# Altium schematic sheet Main.SchDoc
size A3
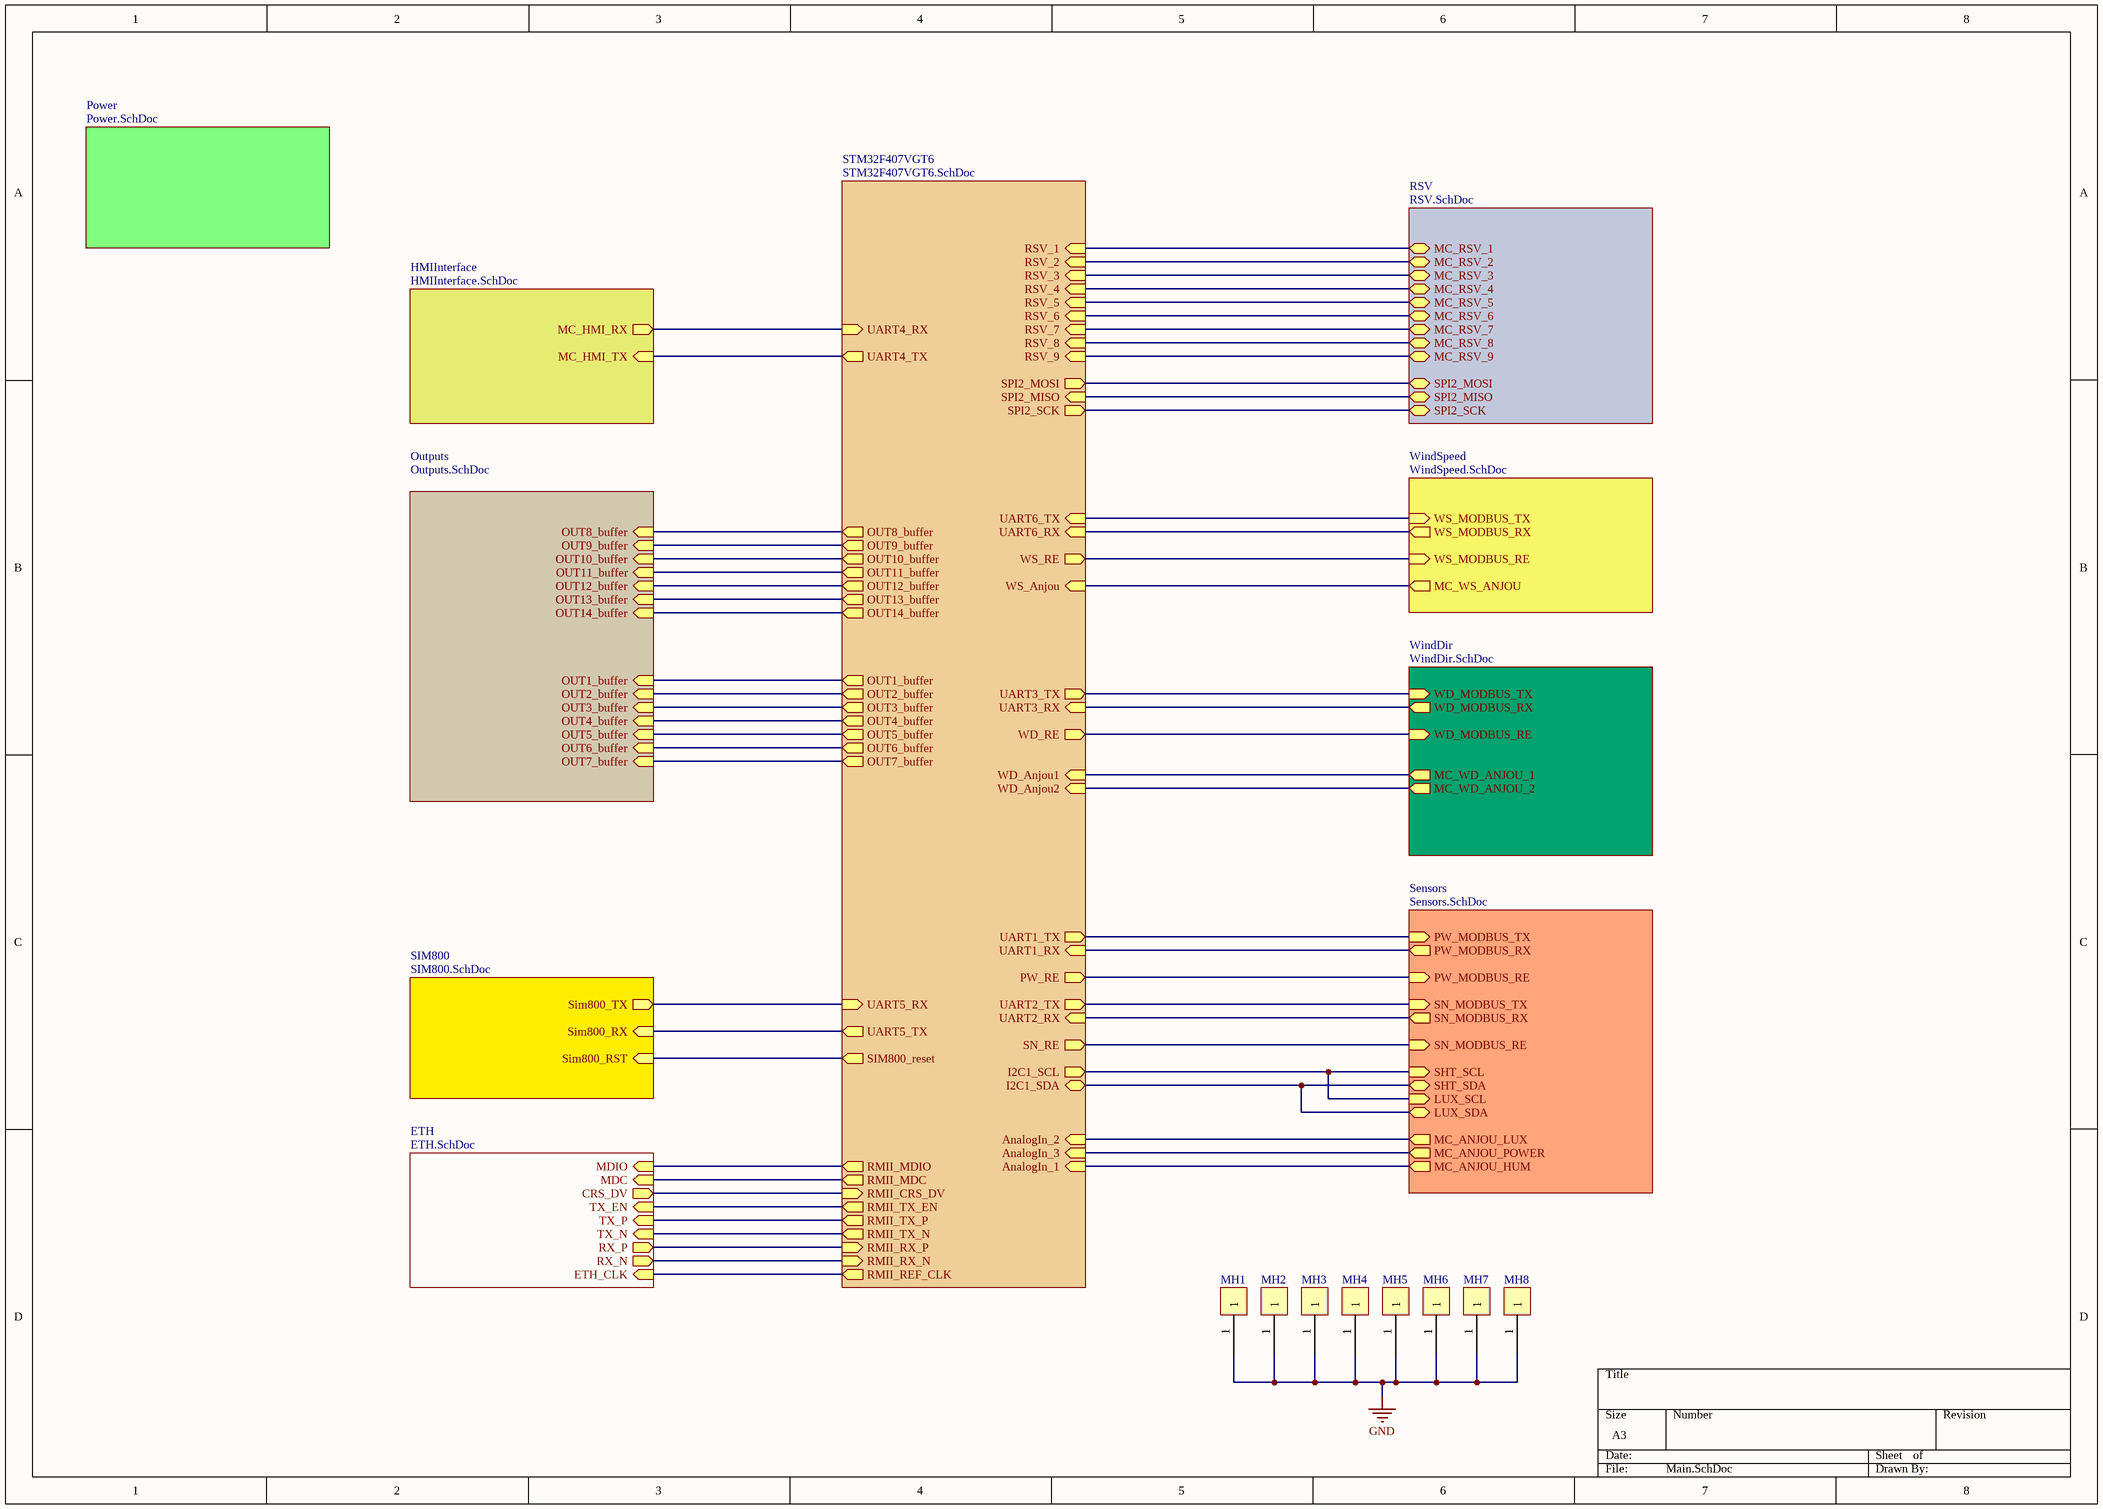
[diagram p0: Main.SchDoc]

## Parts
MH1  HOLE_3mm  [Hole_3mm]  (value not drawn)
MH2  HOLE_3mm  [Hole_3mm]  (value not drawn)
MH3  HOLE_3mm  [Hole_3mm]  (value not drawn)
MH4  HOLE_3mm  [Hole_3mm]  (value not drawn)
MH5  HOLE_3mm  [Hole_3mm]  (value not drawn)
MH6  HOLE_3mm  [Hole_3mm]  (value not drawn)
MH7  HOLE_3mm  [Hole_3mm]  (value not drawn)
MH8  HOLE_3mm  [Hole_3mm]  (value not drawn)

## Sub-sheets
ETH = ETH.SchDoc: ETH_CLK (in), TX_P (in), TX_N (in), CRS_DV (out), RX_N (out), RX_P (out), TX_EN (in), MDC (in), MDIO (in)
HMIInterface = HMIInterface.SchDoc: MC_HMI_RX (out), MC_HMI_TX (in)
Outputs = Outputs.SchDoc: OUT13_buffer (in), OUT6_buffer (in), OUT14_buffer (in), OUT8_buffer (in), OUT7_buffer (in), OUT10_buffer (in), OUT11_buffer (in), OUT4_buffer (in), OUT3_buffer (in), OUT12_buffer (in), OUT9_buffer (in), OUT5_buffer (in), OUT2_buffer (in), OUT1_buffer (in)
Power = Power.SchDoc: no entries
RSV = RSV.SchDoc: MC_RSV_9, MC_RSV_6, MC_RSV_3, MC_RSV_8, MC_RSV_5, MC_RSV_2, MC_RSV_7, MC_RSV_1, MC_RSV_4, SPI2_MOSI, SPI2_MISO, SPI2_SCK
Sensors = Sensors.SchDoc: SN_MODBUS_TX (in), SN_MODBUS_RX (out), SHT_SCL (in), SHT_SDA (bidir), SN_MODBUS_RE (in), LUX_SDA (bidir), LUX_SCL (in), PW_MODBUS_TX (in), MC_ANJOU_HUM (out), PW_MODBUS_RX (out), PW_MODBUS_RE (in), MC_ANJOU_LUX (out), MC_ANJOU_POWER (out)
SIM800 = SIM800.SchDoc: Sim800_RX (in), Sim800_TX (out), Sim800_RST (in)
STM32F407VGT6 = STM32F407VGT6.SchDoc: RMII_MDIO (out), RMII_TX_EN (out), RMII_TX_N (out), RMII_CRS_DV (in), RMII_MDC (out), RMII_RX_P (in), RMII_RX_N (in), RMII_TX_P (out), RMII_REF_CLK (out), UART6_RX (in), UART6_TX (in), UART1_TX (out), UART1_RX (in), UART3_RX (in), UART3_TX (out), UART2_TX (out), UART2_RX (in), UART5_RX (in), UART4_TX (out), UART4_RX (in), UART5_TX (out), WD_RE (out), WD_Anjou1 (in), WD_Anjou2 (in), WS_RE (out), WS_Anjou (in), SN_RE (out), OUT8_buffer (out), OUT9_buffer (out), OUT10_buffer (out), OUT11_buffer (out), OUT12_buffer (out), OUT13_buffer (out), OUT14_buffer (out), OUT5_buffer (out), OUT6_buffer (out), OUT7_buffer (out), OUT1_buffer (out), OUT2_buffer (out), OUT3_buffer (out), OUT4_buffer (out), AnalogIn_2 (in), AnalogIn_3 (in), AnalogIn_1 (in), RSV_2 (in), RSV_1 (in), RSV_3 (in), RSV_4 (in), RSV_5 (in), RSV_6 (in), RSV_7 (in), RSV_8 (in), RSV_9 (in), SIM800_reset (out), SPI2_MOSI (out), SPI2_MISO (in), SPI2_SCK (out), I2C1_SCL (out), I2C1_SDA (bidir), PW_RE (out)
WindDir = WindDir.SchDoc: MC_WD_ANJOU_2 (out), WD_MODBUS_RE (in), WD_MODBUS_RX (out), WD_MODBUS_TX (in), MC_WD_ANJOU_1 (out)
WindSpeed = WindSpeed.SchDoc: WS_MODBUS_TX (in), WS_MODBUS_RE (in), MC_WS_ANJOU (out), WS_MODBUS_RX (out)

## Nets
GND: MH1.1 MH2.1 MH3.1 MH4.1 MH5.1 MH6.1 MH7.1 MH8.1
(unnamed): sheet SIM800/Sim800_RX, sheet STM32F407VGT6/UART5_TX
(unnamed): sheet SIM800/Sim800_TX, sheet STM32F407VGT6/UART5_RX
(unnamed): sheet SIM800/Sim800_RST, sheet STM32F407VGT6/SIM800_reset
(unnamed): sheet Outputs/OUT13_buffer, sheet STM32F407VGT6/OUT13_buffer
(unnamed): sheet Outputs/OUT6_buffer, sheet STM32F407VGT6/OUT6_buffer
(unnamed): sheet Outputs/OUT14_buffer, sheet STM32F407VGT6/OUT14_buffer
(unnamed): sheet Outputs/OUT8_buffer, sheet STM32F407VGT6/OUT8_buffer
(unnamed): sheet Outputs/OUT7_buffer, sheet STM32F407VGT6/OUT7_buffer
(unnamed): sheet Outputs/OUT10_buffer, sheet STM32F407VGT6/OUT10_buffer
(unnamed): sheet Outputs/OUT11_buffer, sheet STM32F407VGT6/OUT11_buffer
(unnamed): sheet Outputs/OUT4_buffer, sheet STM32F407VGT6/OUT4_buffer
(unnamed): sheet Outputs/OUT3_buffer, sheet STM32F407VGT6/OUT3_buffer
(unnamed): sheet Outputs/OUT12_buffer, sheet STM32F407VGT6/OUT12_buffer
(unnamed): sheet Outputs/OUT9_buffer, sheet STM32F407VGT6/OUT9_buffer
(unnamed): sheet Outputs/OUT5_buffer, sheet STM32F407VGT6/OUT5_buffer
(unnamed): sheet Outputs/OUT2_buffer, sheet STM32F407VGT6/OUT2_buffer
(unnamed): sheet Outputs/OUT1_buffer, sheet STM32F407VGT6/OUT1_buffer
(unnamed): sheet HMIInterface/MC_HMI_RX, sheet STM32F407VGT6/UART4_RX
(unnamed): sheet HMIInterface/MC_HMI_TX, sheet STM32F407VGT6/UART4_TX
(unnamed): sheet ETH/ETH_CLK, sheet STM32F407VGT6/RMII_REF_CLK
(unnamed): sheet ETH/TX_P, sheet STM32F407VGT6/RMII_TX_P
(unnamed): sheet ETH/TX_N, sheet STM32F407VGT6/RMII_TX_N
(unnamed): sheet ETH/CRS_DV, sheet STM32F407VGT6/RMII_CRS_DV
(unnamed): sheet ETH/RX_N, sheet STM32F407VGT6/RMII_RX_N
(unnamed): sheet ETH/RX_P, sheet STM32F407VGT6/RMII_RX_P
(unnamed): sheet ETH/TX_EN, sheet STM32F407VGT6/RMII_TX_EN
(unnamed): sheet ETH/MDC, sheet STM32F407VGT6/RMII_MDC
(unnamed): sheet ETH/MDIO, sheet STM32F407VGT6/RMII_MDIO
(unnamed): sheet RSV/MC_RSV_9, sheet STM32F407VGT6/RSV_9
(unnamed): sheet RSV/MC_RSV_6, sheet STM32F407VGT6/RSV_6
(unnamed): sheet RSV/MC_RSV_3, sheet STM32F407VGT6/RSV_3
(unnamed): sheet RSV/MC_RSV_8, sheet STM32F407VGT6/RSV_8
(unnamed): sheet RSV/MC_RSV_5, sheet STM32F407VGT6/RSV_5
(unnamed): sheet RSV/MC_RSV_2, sheet STM32F407VGT6/RSV_2
(unnamed): sheet RSV/MC_RSV_7, sheet STM32F407VGT6/RSV_7
(unnamed): sheet RSV/MC_RSV_1, sheet STM32F407VGT6/RSV_1
(unnamed): sheet RSV/MC_RSV_4, sheet STM32F407VGT6/RSV_4
(unnamed): sheet RSV/SPI2_MOSI, sheet STM32F407VGT6/SPI2_MOSI
(unnamed): sheet RSV/SPI2_MISO, sheet STM32F407VGT6/SPI2_MISO
(unnamed): sheet RSV/SPI2_SCK, sheet STM32F407VGT6/SPI2_SCK
(unnamed): sheet WindSpeed/WS_MODBUS_TX, sheet STM32F407VGT6/UART6_TX
(unnamed): sheet WindSpeed/WS_MODBUS_RE, sheet STM32F407VGT6/WS_RE
(unnamed): sheet WindSpeed/MC_WS_ANJOU, sheet STM32F407VGT6/WS_Anjou
(unnamed): sheet WindSpeed/WS_MODBUS_RX, sheet STM32F407VGT6/UART6_RX
(unnamed): sheet WindDir/MC_WD_ANJOU_2, sheet STM32F407VGT6/WD_Anjou2
(unnamed): sheet WindDir/WD_MODBUS_RE, sheet STM32F407VGT6/WD_RE
(unnamed): sheet WindDir/WD_MODBUS_RX, sheet STM32F407VGT6/UART3_RX
(unnamed): sheet WindDir/WD_MODBUS_TX, sheet STM32F407VGT6/UART3_TX
(unnamed): sheet WindDir/MC_WD_ANJOU_1, sheet STM32F407VGT6/WD_Anjou1
(unnamed): sheet Sensors/SN_MODBUS_TX, sheet STM32F407VGT6/UART2_TX
(unnamed): sheet Sensors/SN_MODBUS_RX, sheet STM32F407VGT6/UART2_RX
(unnamed): sheet Sensors/SHT_SCL, sheet Sensors/LUX_SCL, sheet STM32F407VGT6/I2C1_SCL
(unnamed): sheet Sensors/SHT_SDA, sheet Sensors/LUX_SDA, sheet STM32F407VGT6/I2C1_SDA
(unnamed): sheet Sensors/SN_MODBUS_RE, sheet STM32F407VGT6/SN_RE
(unnamed): sheet Sensors/PW_MODBUS_TX, sheet STM32F407VGT6/UART1_TX
(unnamed): sheet Sensors/MC_ANJOU_HUM, sheet STM32F407VGT6/AnalogIn_1
(unnamed): sheet Sensors/PW_MODBUS_RX, sheet STM32F407VGT6/UART1_RX
(unnamed): sheet Sensors/PW_MODBUS_RE, sheet STM32F407VGT6/PW_RE
(unnamed): sheet Sensors/MC_ANJOU_LUX, sheet STM32F407VGT6/AnalogIn_2
(unnamed): sheet Sensors/MC_ANJOU_POWER, sheet STM32F407VGT6/AnalogIn_3